# EAGLE schematic 19260^1 (EAGLE 7.6.0)
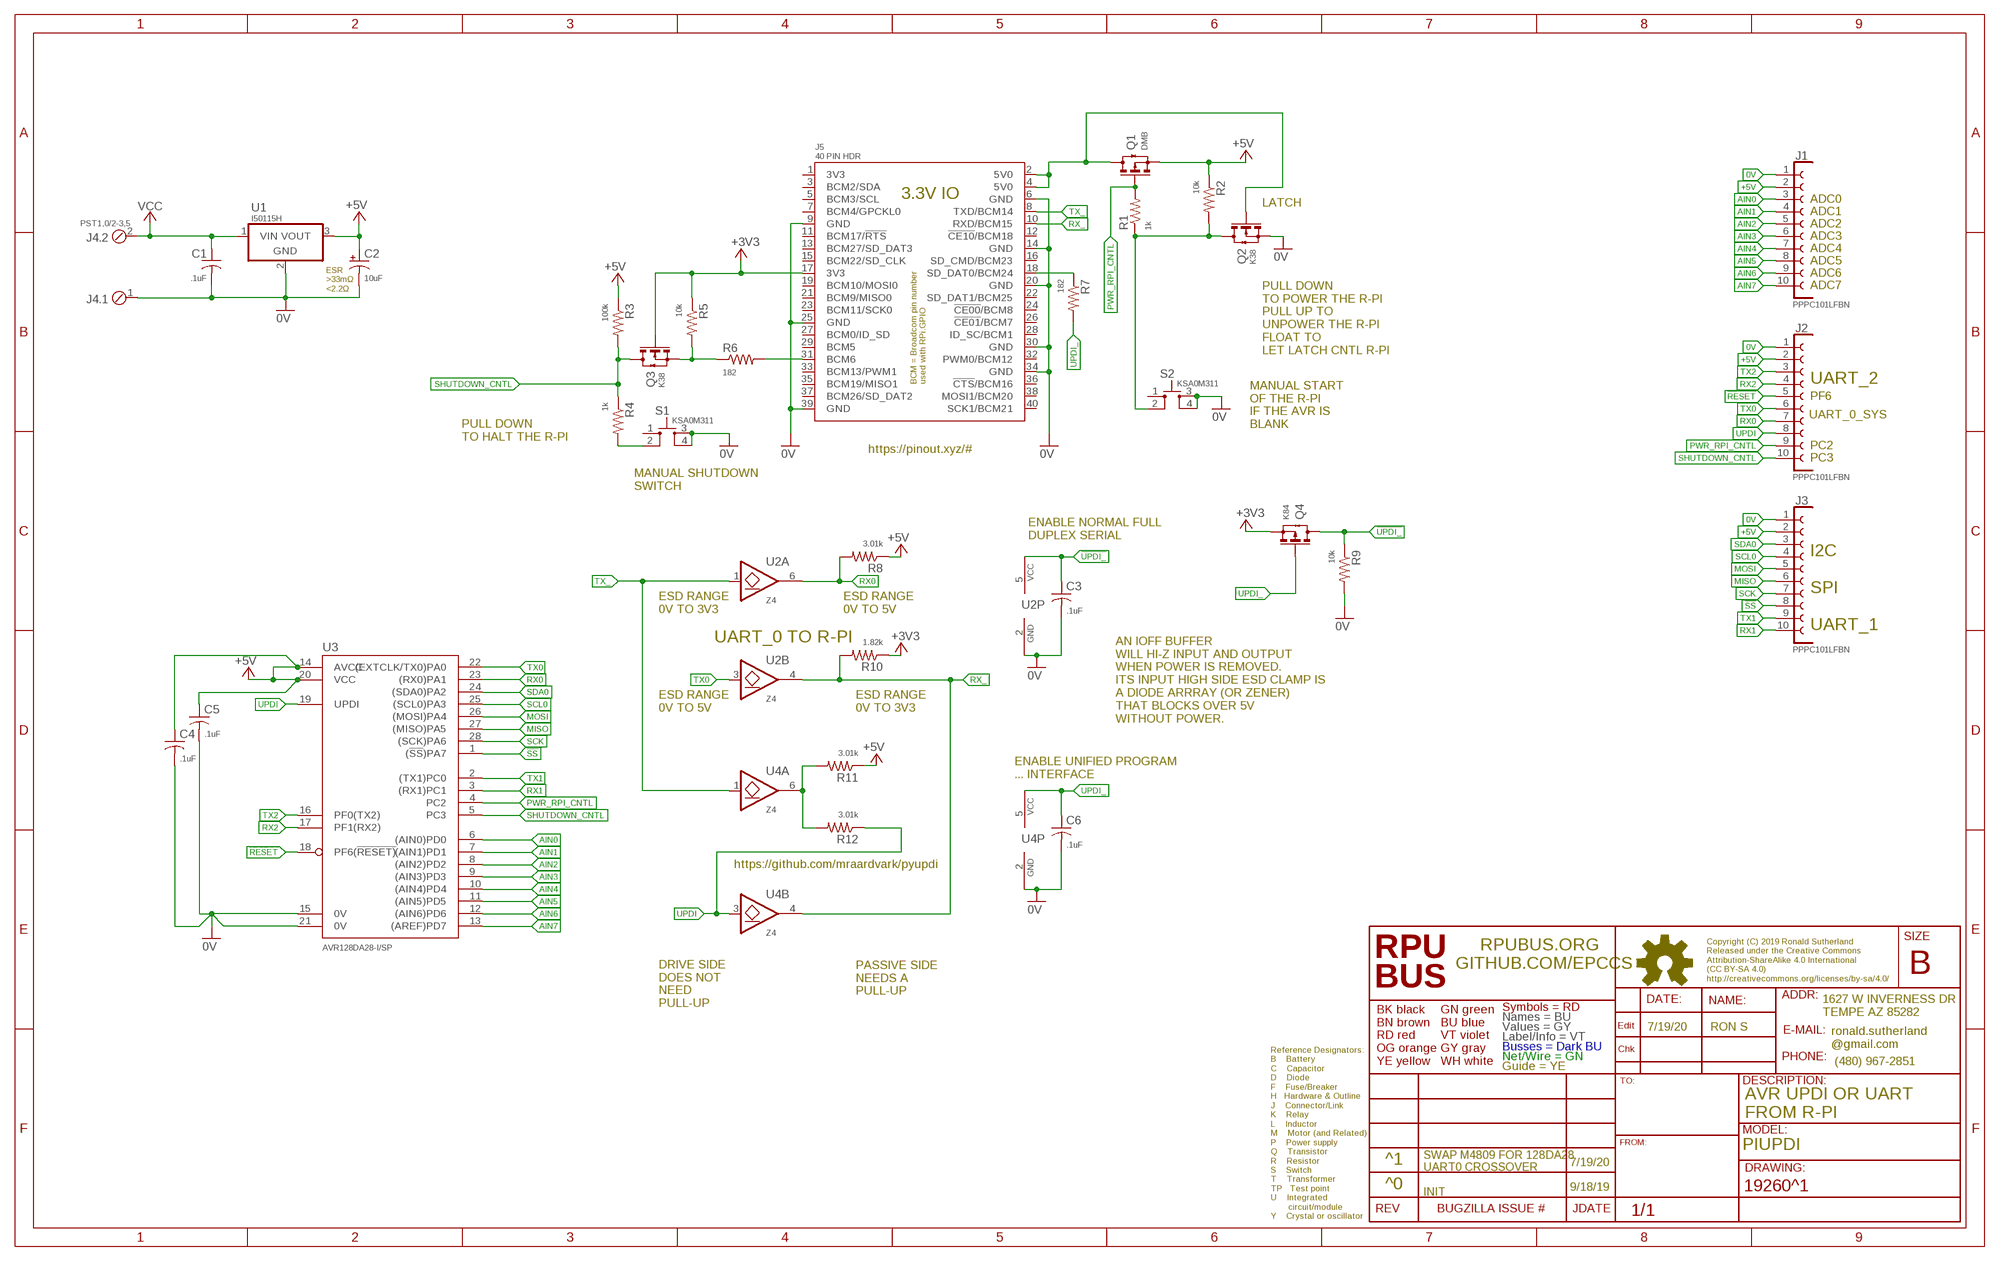
[diagram p0: schematic, sheet 1]

## Parts
C1  .1uF  CC0603A  [C0603(1608)]
C2  10uF  CT1206  [3216]
C3  .1uF  CC0603A  [C0603(1608)]
C4  .1uF  CC0603A  [C0603(1608)]
C5  .1uF  CC0603A  [C0603(1608)]
C6  .1uF  CC0603A  [C0603(1608)]
J1  PPPC101LFBN  F1X10  [F1X10]
J2  PPPC101LFBN  F1X10  [F1X10]
J3  PPPC101LFBN  F1X10  [F1X10]
J4  PST1,0/2-3,5  MCV2  [MCV2]
J5  40 PIN HDR  RPI-ZERO  [RASPI_ZERO_H40PIN]
Q1  DMB  N-CHSOT23  [SOT23]
Q2  K38  N-CHSOT23  [SOT23]
Q3  K38  N-CHSOT23  [SOT23]
Q4  K84  N-CHSOT23  [SOT23]
R1  1k  R0805  [C0805(2012)]
R2  10k  R0805  [C0805(2012)]
R3  100k  R0805  [C0805(2012)]
R4  1k  R0805  [C0805(2012)]
R5  10k  R0805  [C0805(2012)]
R6  182  R0805  [C0805(2012)]
R7  182  R0805  [C0805(2012)]
R8  3.01k  R0805  [C0805(2012)]
R9  10k  R0805  [C0805(2012)]
R10  1.82k  R0805  [C0805(2012)]
R11  3.01k  R0805  [C0805(2012)]
R12  3.01k  R0805  [C0805(2012)]
S1  KSA0M311  [0M311]
S2  KSA0M311  [0M311]
U1  I50115H  OKI-78SR-H  [OKI-78SR-H]
U2  Z4  2G07SOT26  [SOT23-6,SOT26]
U3  AVR128DA28-I/SP  [DIL28-3]
U4  Z4  2G07SOT26  [SOT23-6,SOT26]

## Nets
0V: C1.2 C2.- C3.2 C4.2 C5.2 C6.2 J1.1 J2.1 J3.1 J4.1 J5.6(GND) J5.9(GND) J5.14(GND) J5.20(GND) J5.25(GND) J5.30(GND) J5.34(GND) J5.39(GND) Q2.2(S)(S) R9.2 S1.3 S1.4 S2.3 S2.4 U1.2(GND) U2.2(P:GND) U3.15(0V) U3.21(0V) U4.2(P:GND)
5V0@2: J5.2(5V0) J5.4(5V0) Q1.3(D)(D) Q2.1(G)(G)
!RESET: J2.5 U3.18(PF6(!RESET))
!SS: J3.8 U3.1((!SS!)PA7)
!UPDI_: C3.1 Q4.3(D)(D) R9.1 U2.5(P:VCC)
+3V3: J5.17(3V3) Q3.1(G)(G) Q4.2(S)(S) R5.1 R10.1
+5V: C2.+ C4.1 C5.1 J1.2 J2.2 J3.2 Q1.2(S)(S) R2.1 R3.1 R8.1 R11.1 U1.3(VOUT) U3.14(AVCC) U3.20(VCC)
AIN0: J1.3 U3.6((AIN0)PD0)
AIN1: J1.4 U3.7((AIN1)PD1)
AIN2: J1.5 U3.8((AIN2)PD2)
AIN3: J1.6 U3.9((AIN3)PD3)
AIN4: J1.7 U3.10((AIN4)PD4)
AIN5: J1.8 U3.11((AIN5)PD5)
AIN6: J1.9 U3.12((AIN6)PD6)
AIN7: J1.10 U3.13((AREF)PD7)
MISO: J3.6 U3.27((MISO)PA5)
MOSI: J3.5 U3.26((MOSI)PA4)
N$1: R4.2 S1.2
N$2: J5.18(SD_DAT0/BCM24) R7.1
N$3: J5.31(BCM6) R6.2
N$4: R11.2 R12.2 U4.6(A:O)
N$6: Q2.3(D)(D) R1.1 R2.2 S2.2
PWR_RPI_CNTL: J2.9 Q1.1(G)(G) R1.2 U3.4(PC2)
RX0: J2.7 R8.2 U2.6(A:O) U3.23((RX0)PA1)
RX1: J3.10 U3.3((RX1)PC1)
RX2: J2.4 U3.17(PF1(RX2))
RX_: J5.10(RXD/BCM15) R10.2 U2.4(B:O) U4.4(B:O)
SCK: J3.7 U3.28((SCK)PA6)
SCL0: J3.4 U3.25((SCL0)PA3)
SDA0: J3.3 U3.24((SDA0)PA2)
SHUTDOWN: Q3.2(S)(S) R5.2 R6.1
SHUTDOWN_CNTL: J2.10 Q3.3(D)(D) R3.2 R4.1 U3.5(PC3)
TX0: J2.6 U2.3(B:I) U3.22((EXTCLK/TX0)PA0)
TX1: J3.9 U3.2((TX1)PC0)
TX2: J2.3 U3.16(PF0(TX2))
TX_: J5.8(TXD/BCM14) U2.1(A:I) U4.1(A:I)
UPDI: J2.8 R12.1 U3.19(UPDI) U4.3(B:I)
UPDI_: C6.1 Q4.1(G)(G) R7.2 U4.5(P:VCC)
VCC: C1.1 J4.2 U1.1(VIN)
Unconnected: J5.1(3V3) J5.3(BCM2/SDA) J5.5(BCM3/SCL) J5.7(BCM4/GPCKL0) J5.11(BCM17/!RTS!) J5.12(!CE10!/BCM18) J5.13(BCM27/SD_DAT3) J5.15(BCM22/SD_CLK) J5.16(SD_CMD/BCM23) J5.19(BCM10/MOSI0) J5.21(BCM9/MISO0) J5.22(SD_DAT1/BCM25) J5.23(BCM11/SCK0) J5.24(!CE00!/BCM8) J5.26(!CE01!/BCM7) J5.27(BCM0/ID_SD) J5.28(ID_SC/BCM1) J5.29(BCM5) J5.32(PWM0/BCM12) J5.33(BCM13/PWM1) J5.35(BCM19/MISO1) J5.36(!CTS!/BCM16) J5.37(BCM26/SD_DAT2) J5.38(MOSI1/BCM20) J5.40(SCK1/BCM21) S1.1 S2.1

## Notes on the sheet
- ADC0
- LATCH
- ADC1
- ADC2
- ADC3
- ADC4
- ADC5
- ADC6
- ADC7
- ESR
  >33mΩ
  <2.2Ω
- PULL DOWN 
  TO POWER THE R-PI
  PULL UP TO 
  UNPOWER THE R-PI
  FLOAT TO
  LET LATCH CNTL R-PI
- UART_2
- PF6
- UART_0_SYS
- MANUAL START
  OF THE R-PI
  IF THE AVR IS 
  BLANK
- PULL DOWN
  TO HALT THE R-PI
- PC2
- https://pinout.xyz/#
- PC3
- MANUAL SHUTDOWN
  SWITCH
- ENABLE NORMAL FULL
  DUPLEX SERIAL
- I2C
- SPI
- ESD RANGE
  0V TO 3V3
- ESD RANGE
  0V TO 5V
- UART_1
- UART_0 TO R-PI
- ESD RANGE
  0V TO 5V
- ESD RANGE
  0V TO 3V3
- AN IOFF BUFFER
  WILL HI-Z INPUT AND OUTPUT
  WHEN POWER IS REMOVED.
  ITS INPUT HIGH SIDE ESD CLAMP IS 
  A DIODE ARRRAY (OR ZENER) 
  THAT BLOCKS OVER 5V
  WITHOUT POWER.
- ENABLE UNIFIED PROGRAM 
  ... INTERFACE
- https://github.com/mraardvark/pyupdi
- PASSIVE SIDE
  NEEDS A
  PULL-UP
- DRIVE SIDE
  DOES NOT
  NEED 
  PULL-UP
- 7/19/20 | RON S
- AVR UPDI OR UART
  FROM R-PI
- PIUPDI
- ^1 | 7/19/20
- SWAP M4809 FOR 128DA28
  UART0 CROSSOVER
- ^0 | 9/18/19
- INIT

## Library data of the parts
C1 C3-C6 = C-C:C: CAPACITOR Symbol
C2 = C-T:CT: Tantalum Electrolytic Capacitor
J1-J3 = J-HDR2.54mm:F1X10: FEMALE HEADER 10POS
J4 = J-HDR3.5mm:MCV2: MCV 1,5/ 2-G-3,5-RN [PHOENIX CONTACT,1731471] CONN HEADER SHROUDED 2POS 3.5MM MCVR 1,5/ 2-ST-3,5 [PHOENIX CONTACT,1863152] CONN PLUG 2POS SCREW 3.5MM PST 1,0/2-3,5 [PHOENIX CONTACT,1945096] CONN HEADER STRIP PIN 2POS 3.5MM PT1,5/2-PVH-3,5 [PHOENIX CONTACT,1984015] CONN PLUG STRIP 2POS 3.5MM
J5 = U-Pi:RPI-ZERO: Raspberry Pi Zero https://pinout.xyz/ NOTE: WiFi is needed see https://www.kickstarter.com/projects/1991736672/iot-hat-for-raspberry-pi-a-must-have-for-pi-zero
Q1 Q4 = Q-PCH:N-CH?*: ENHANCEMENT MODE MOSFET SOT23 is BSS138 pinout
Q2 Q3 = Q-NCH:N-CH?*: ENHANCEMENT MODE MOSFET SOT23 is BSS138 pinout
R1-R12 = R-C:R: Resiistor American-style symbol
S1 S2 = S-Tactile:KSA: KSA0M311 [C&K,KSA0M311LFT] SWITCH TACTILE SEALED SPST-NO 50MA 32V
U1 = P-DCDC:OKI-78SR: OKI-78SR OKI-78SR-5/1.5-W36H-C 5V@1.5A Horizontal Mount OKI-78SR-5/1.5-W36-C 5V@1.5A Vert Mount OKI-78SR-3.3/1.5-W36H-C 3.3V@1.5A Horizontal Mount OKI-78SR-3.3/1.5-W36-C 3.3V@1.5A Vert Mount Murata Power Solutions 7 to 36 VDC input range need to verify pinout
U2 U4 = U-7400:2G07: BUFFER OPEN DRAIN Z4 [DIODES,74LVC2G07W6-7] LOGIC BUFFER OPEN DRAIN SOT26
U3 = U-AVR:AVR128DA28: AVR128DA28-I/[SO | SP] IC MCU 8BIT 128kB FLASH 16kB SRAM SP = SPDIP 28 PIN SO = SOIC 28 PIN

## Net classes
0 default: width 0.178 mm, drill 0.33 mm